# Altium project Audio_Research.PrjPcb (part 4 of 4)

## Sheet Audio_Input_Mic_Preamp.SchDoc: Microphone Preamp
size 381 x 241 mm; DrawnBy: Connor Dack; Engineer: Connor Dack; DocumentNumber: 14; Revision: 1.0; SheetNumber: 14; SheetTotal: 20
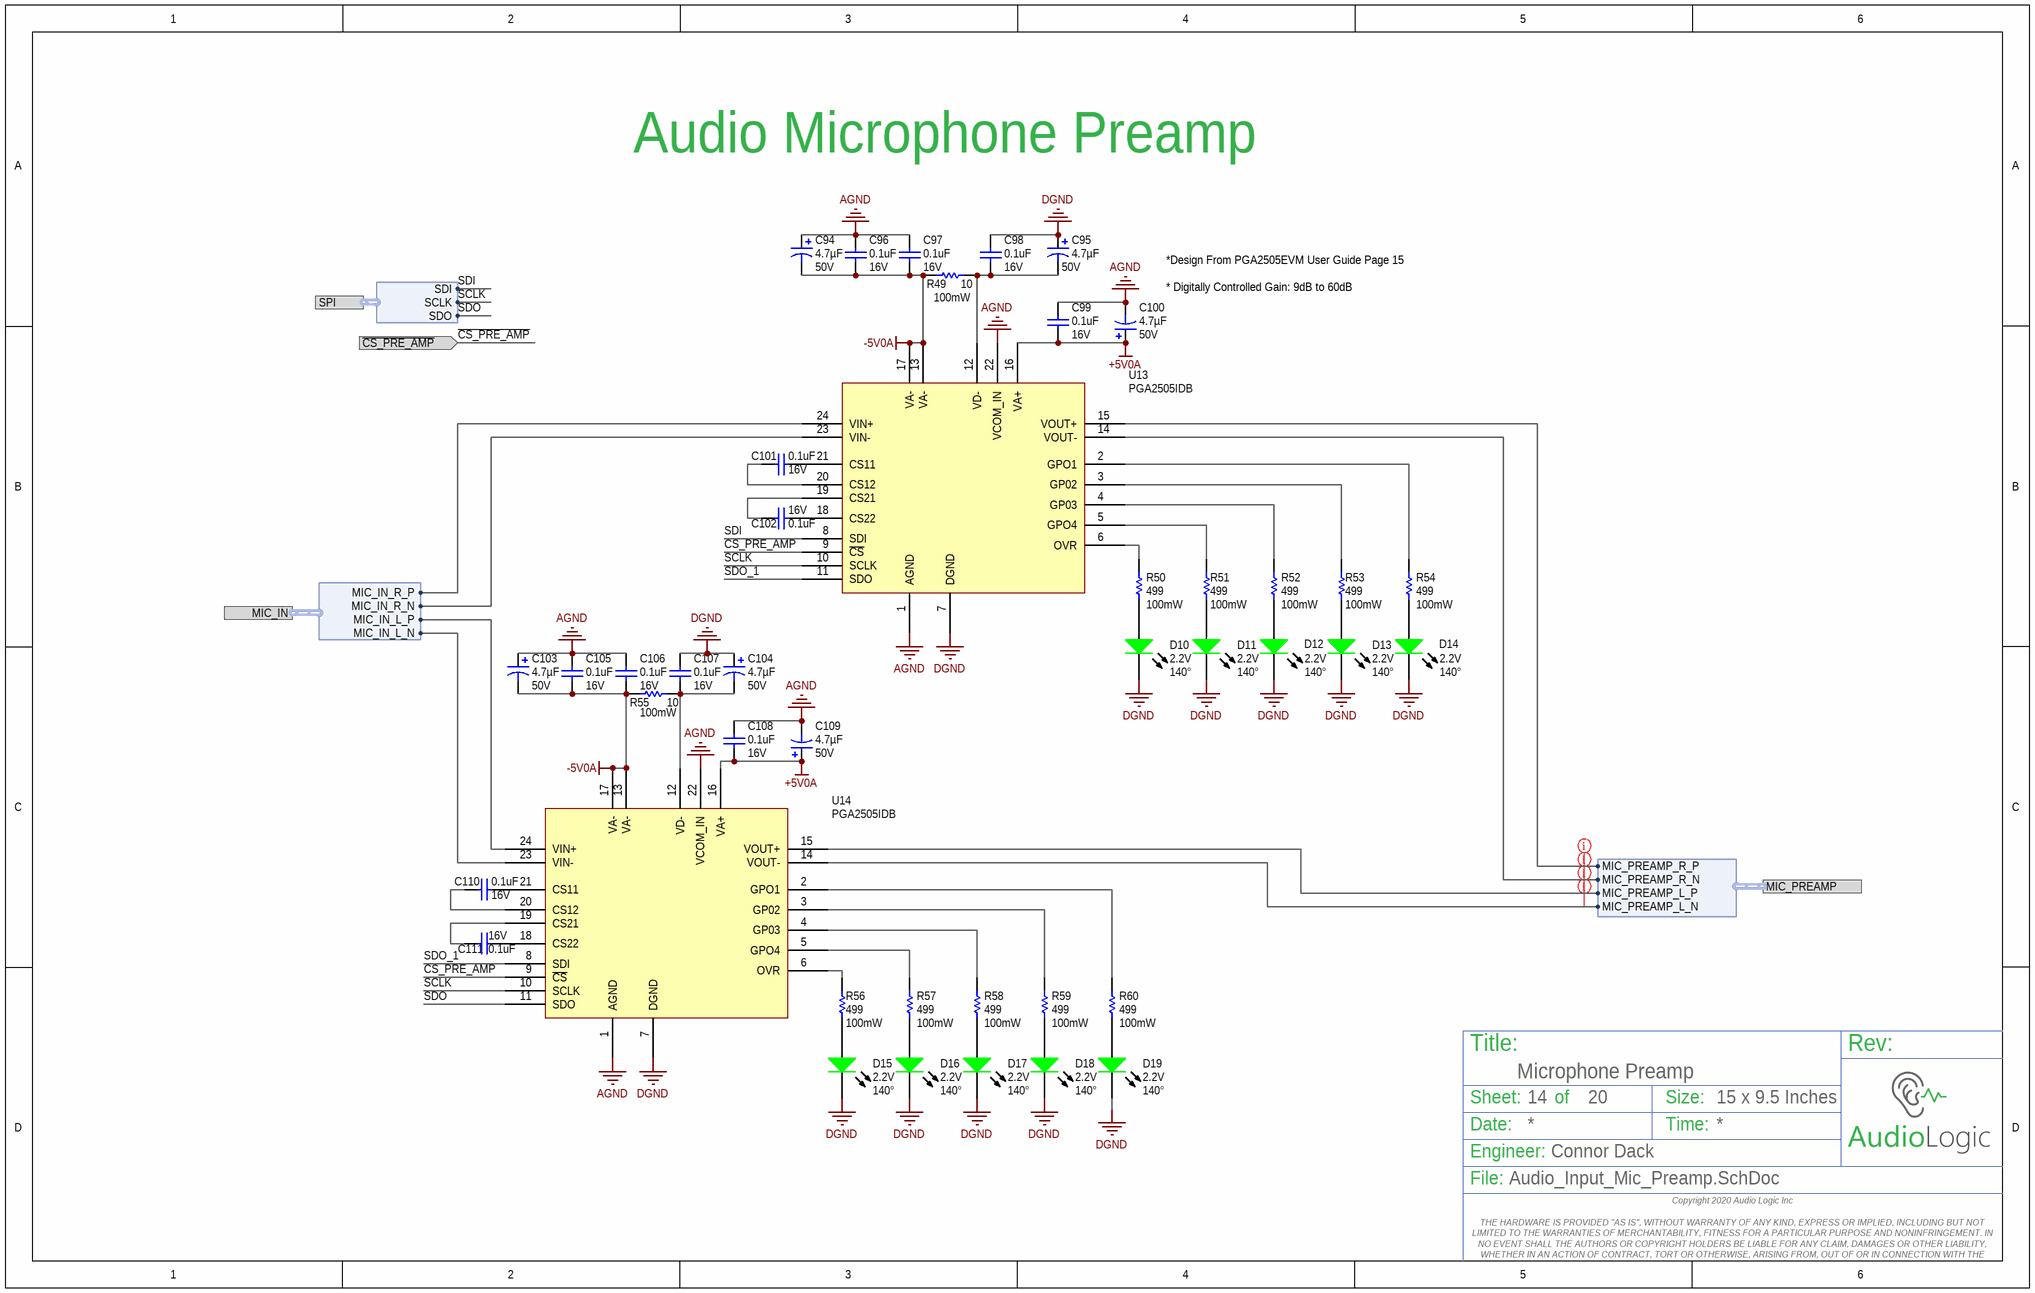
[diagram p11: Audio_Input_Mic_Preamp.SchDoc]

### Parts
C94  Voltage - Rated: 50V  Capacitance: 4.7µF  [2917-Tantalum-Cap]  (hidden comment: T495D475K050ATE275)
C95  Voltage - Rated: 50V  Capacitance: 4.7µF  [2917-Tantalum-Cap]  (hidden comment: T495D475K050ATE275)
C96  Voltage Rating: 16V  Capacitance: 0.1uF  [3-0603_L]  (hidden comment: CL10F104ZO8NNNC)
C97  Voltage Rating: 16V  Capacitance: 0.1uF  [3-0603_L]  (hidden comment: CL10F104ZO8NNNC)
C98  Voltage Rating: 16V  Capacitance: 0.1uF  [3-0603_L]  (hidden comment: CL10F104ZO8NNNC)
C99  Voltage Rating: 16V  Capacitance: 0.1uF  [3-0603_L]  (hidden comment: CL10F104ZO8NNNC)
C100  Voltage - Rated: 50V  Capacitance: 4.7µF  [2917-Tantalum-Cap]  (hidden comment: T495D475K050ATE275)
C101  Voltage Rating: 16V  Capacitance: 0.1uF  [3-0603_L]  (hidden comment: CL10F104ZO8NNNC)
C102  Voltage Rating: 16V  Capacitance: 0.1uF  [3-0603_L]  (hidden comment: CL10F104ZO8NNNC)
C103  Voltage - Rated: 50V  Capacitance: 4.7µF  [2917-Tantalum-Cap]  (hidden comment: T495D475K050ATE275)
C104  Voltage - Rated: 50V  Capacitance: 4.7µF  [2917-Tantalum-Cap]  (hidden comment: T495D475K050ATE275)
C105  Voltage Rating: 16V  Capacitance: 0.1uF  [3-0603_L]  (hidden comment: CL10F104ZO8NNNC)
C106  Voltage Rating: 16V  Capacitance: 0.1uF  [3-0603_L]  (hidden comment: CL10F104ZO8NNNC)
C107  Voltage Rating: 16V  Capacitance: 0.1uF  [3-0603_L]  (hidden comment: CL10F104ZO8NNNC)
C108  Voltage Rating: 16V  Capacitance: 0.1uF  [3-0603_L]  (hidden comment: CL10F104ZO8NNNC)
C109  Voltage - Rated: 50V  Capacitance: 4.7µF  [2917-Tantalum-Cap]  (hidden comment: T495D475K050ATE275)
C110  Voltage Rating: 16V  Capacitance: 0.1uF  [3-0603_L]  (hidden comment: CL10F104ZO8NNNC)
C111  Voltage Rating: 16V  Capacitance: 0.1uF  [3-0603_L]  (hidden comment: CL10F104ZO8NNNC)
D10  Voltage - Forward (Vf) Typ: 2.2V  Viewing Angle: 140°  [DIOCP3216X11L]  (hidden comment: LED_GREEN 2)
D11  Voltage - Forward (Vf) Typ: 2.2V  Viewing Angle: 140°  [DIOCP3216X11L]  (hidden comment: LED_GREEN 2)
D12  Voltage - Forward (Vf) Typ: 2.2V  Viewing Angle: 140°  [DIOCP3216X11L]  (hidden comment: LED_GREEN 2)
D13  Voltage - Forward (Vf) Typ: 2.2V  Viewing Angle: 140°  [DIOCP3216X11L]  (hidden comment: LED_GREEN 2)
D14  Voltage - Forward (Vf) Typ: 2.2V  Viewing Angle: 140°  [DIOCP3216X11L]  (hidden comment: LED_GREEN 2)
D15  Voltage - Forward (Vf) Typ: 2.2V  Viewing Angle: 140°  [DIOCP3216X11L]  (hidden comment: LED_GREEN 2)
D16  Voltage - Forward (Vf) Typ: 2.2V  Viewing Angle: 140°  [DIOCP3216X11L]  (hidden comment: LED_GREEN 2)
D17  Voltage - Forward (Vf) Typ: 2.2V  Viewing Angle: 140°  [DIOCP3216X11L]  (hidden comment: LED_GREEN 2)
D18  Voltage - Forward (Vf) Typ: 2.2V  Viewing Angle: 140°  [DIOCP3216X11L]  (hidden comment: LED_GREEN 2)
D19  Voltage - Forward (Vf) Typ: 2.2V  Viewing Angle: 140°  [DIOCP3216X11L]  (hidden comment: LED_GREEN 2)
R49  Power (Watts): 100mW  Resistance (Ohms): 10  [2-0402_R_L]  (hidden comment: ERJ-2RKF10R0X)
R50  Power (Watts): 100mW  Resistance (Ohms): 499  [3-0603_R_L]  (hidden comment: ERJ-3EKF4990V)
R51  Power (Watts): 100mW  Resistance (Ohms): 499  [3-0603_R_L]  (hidden comment: ERJ-3EKF4990V)
R52  Power (Watts): 100mW  Resistance (Ohms): 499  [3-0603_R_L]  (hidden comment: ERJ-3EKF4990V)
R53  Power (Watts): 100mW  Resistance (Ohms): 499  [3-0603_R_L]  (hidden comment: ERJ-3EKF4990V)
R54  Power (Watts): 100mW  Resistance (Ohms): 499  [3-0603_R_L]  (hidden comment: ERJ-3EKF4990V)
R55  Power (Watts): 100mW  Resistance (Ohms): 10  [2-0402_R_L]  (hidden comment: ERJ-2RKF10R0X)
R56  Power (Watts): 100mW  Resistance (Ohms): 499  [3-0603_R_L]  (hidden comment: ERJ-3EKF4990V)
R57  Power (Watts): 100mW  Resistance (Ohms): 499  [3-0603_R_L]  (hidden comment: ERJ-3EKF4990V)
R58  Power (Watts): 100mW  Resistance (Ohms): 499  [3-0603_R_L]  (hidden comment: ERJ-3EKF4990V)
R59  Power (Watts): 100mW  Resistance (Ohms): 499  [3-0603_R_L]  (hidden comment: ERJ-3EKF4990V)
R60  Power (Watts): 100mW  Resistance (Ohms): 499  [3-0603_R_L]  (hidden comment: ERJ-3EKF4990V)
U13  Microphone Preamp  [SOP65P780X200-24N]  (value not drawn)
U14  Microphone Preamp  [SOP65P780X200-24N]  (value not drawn)

### Ports
MIC_IN (harness MIC_IN), MIC_PREAMP (harness MIC_PREAMP), SPI (harness SPI), ~{CS_PRE_AMP} (in)

### Harnesses
MIC_IN: MIC_IN_R_P, MIC_IN_R_N, MIC_IN_L_N, MIC_IN_L_P
MIC_PREAMP: MIC_PREAMP_R_P, MIC_PREAMP_R_N, MIC_PREAMP_L_N, MIC_PREAMP_L_P
SPI: SDI, SCLK, SDO

### Nets
+5V0A: C99.2 C100.1(P) C108.2 C109.1(P) U13.16(VA+) U14.16(VA+)
-5V0A: C94.2(N) C96.2 C97.2 C103.2(N) C105.2 C106.2 R49.1 R55.1 U13.13(VA-) U13.17(VA-) U14.13(VA-) U14.17(VA-)
AGND: C94.1(P) C95.1(P) C96.1 C97.1 C98.1 C99.1 C100.2(N) C103.1(P) C104.1(P) C105.1 C106.1 C107.1 C108.1 C109.2(N) D10.2(K) D11.2(K) D12.2(K) D13.2(K) D14.2(K) D15.2(K) D16.2(K) D17.2(K) D18.2(K) D19.2(K) U13.1(AGND) U13.7(DGND) U13.22(VCOM_IN) U14.1(AGND) U14.7(DGND) U14.22(VCOM_IN)  [also labelled DGND]
~{CS_PRE_AMP}: U13.9(~{CS}) U14.9(~{CS}) ; port ~{CS_PRE_AMP}
SCLK: U13.10(SCLK) U14.10(SCLK) ; port SPI.SCLK
SDI: U13.8(SDI) ; port SPI.SDI
SDO: U14.11(SDO) ; port SPI.SDO
SDO_1: U13.11(SDO) U14.8(SDI)
NetC70_1: U14.23(VIN-) ; port MIC_IN.MIC_IN_L_N
NetC76_1: U14.24(VIN+) ; port MIC_IN.MIC_IN_L_P
NetC85_1: U13.23(VIN-) ; port MIC_IN.MIC_IN_R_N
NetC90_1: U13.24(VIN+) ; port MIC_IN.MIC_IN_R_P
NetC95_2: C95.2(N) C98.2 R49.2 U13.12(VD-)
NetC101_1: C101.1 U13.21(CS11)
NetC101_2: C101.2 U13.20(CS12)
NetC102_1: C102.1 U13.18(CS22)
NetC102_2: C102.2 U13.19(CS21)
NetC104_2: C104.2(N) C107.2 R55.2 U14.12(VD-)
NetC110_1: C110.1 U14.21(CS11)
NetC110_2: C110.2 U14.20(CS12)
NetC111_1: C111.1 U14.18(CS22)
NetC111_2: C111.2 U14.19(CS21)
NetD10_1: D10.1(A) R50.1
NetD11_1: D11.1(A) R51.1
NetD12_1: D12.1(A) R52.1
NetD13_1: D13.1(A) R53.1
NetD14_1: D14.1(A) R54.1
NetD15_1: D15.1(A) R56.1
NetD16_1: D16.1(A) R57.1
NetD17_1: D17.1(A) R58.1
NetD18_1: D18.1(A) R59.1
NetD19_1: D19.1(A) R60.1
NetR50_2: R50.2 U13.6(OVR)
NetR51_2: R51.2 U13.5(GPO4)
NetR52_2: R52.2 U13.4(GP03)
NetR53_2: R53.2 U13.3(GP02)
NetR54_2: R54.2 U13.2(GPO1)
NetR56_2: R56.2 U14.6(OVR)
NetR57_2: R57.2 U14.5(GPO4)
NetR58_2: R58.2 U14.4(GP03)
NetR59_2: R59.2 U14.3(GP02)
NetR60_2: R60.2 U14.2(GPO1)
NetU1_53: U14.15(VOUT+) ; port MIC_PREAMP.MIC_PREAMP_L_P
NetU1_54: U14.14(VOUT-) ; port MIC_PREAMP.MIC_PREAMP_L_N
NetU1_55: U13.15(VOUT+) ; port MIC_PREAMP.MIC_PREAMP_R_P
NetU1_56: U13.14(VOUT-) ; port MIC_PREAMP.MIC_PREAMP_R_N

### Layout directives
net class Mic_Preamp_In: NetU1_53, NetU1_54, NetU1_55, NetU1_56

### Notes on the sheet
- Audio Microphone Preamp
- (near C100) *Design From PGA2505EVM User Guide Page 15
  * Digitally Controlled Gain: 9dB to 60dB
- Title:
- Sheet:
- of
- Size:
- 15 x 9.5 Inches
- Rev:
- Date:
- Engineer:
- Time:
- File:
- Copyright 2020 Audio Logic Inc
  THE HARDWARE IS PROVIDED "AS IS", WITHOUT WARRANTY OF ANY KIND, EXPRESS OR IMPLIED, INCLUDING BUT NOT LIMITED TO THE WARRANTIES OF MERCHANTABILITY, FITNESS FOR A PARTICULAR PURPOSE AND NONINFRINGEMENT. IN NO EVENT SHALL THE AUTHORS OR COPYRIGHT HOLDERS BE LIABLE FOR ANY CLAIM, DAMAGES OR OTHER LIABILITY, WHETHER IN AN ACTION OF CONTRACT, TORT OR OTHERWISE, ARISING FROM, OUT OF OR IN CONNECTION WITH THE HARDWARE OR THE USE OR OTHER DEALINGS IN THE HARDWARE.

### Library data of the parts
C94 C95 C100 C103 C104 C109 = T495D475K050ATE275: CAP TANT 4.7UF 50V 10% 2917; Manufacturer: KEMET; Manufacturer Size Code: D; Type: Molded; ESR (Equivalent Series Resistance): 275 mOhm; Lifetime @ Temp.: 2000 Hrs @ 85°C; Supplier 1: Digi-Key; Manufacturer Part Number: T495D475K050ATE275; RoHS: RoHS Compliant; Category: Capacitors; Stock 1: 9255; Pricing 1: 1=2.05, 10=1.656, 25=1.5052, 50=1.445, 100=1.2644, 250=1.0838 (USD); Packaging: Cut Tape (CT); Part Status: Active; Tolerance: ±10%; Operating Temperature: -55°C ~ 125°C; Mounting Type: Surface Mount; Package / Case: 2917 (7343 Metric); Size / Dimension: 0.287" L x 0.169" W (7.30mm x 4.30mm); Height - Seated (Max): 0.122" (3.10mm); Lead Spacing: -; Features: General Purpose; Failure Rate: -; ComponentLink1URL: http://www.kemet.com/docfinder?Partnumber=T495D475K050ATE275; ComponentLink1Description: http://www.kemet.com/docfinder?Partnumber=T495D475K050ATE275; Supplier Part Number 1: 399-4786-1-ND
C96-C99 C101 C102 C105-C108 C110 C111 = CL10F104ZO8NNNC: CAP CER 0.1UF 16V Y5V 0603; Manufacturer: Samsung; Tolerance: 80%; Supplier 1: Digi-Key; Stock 1: 40000; Pricing 1: 1=0.1, 10=0.038, 100=0.0169, 500=0.01208, 1000=0.00949 (USD); Mount: Surface Mount; Case/Package: 0603; Case Code (Metric): 1608; Case Code (Imperial): 0603; Min Operating Temperature: -30°C; Max Operating Temperature: 85°C; Package Quantity: 1; Packaging: Tape and Reel; Dielectric: Y5V; Length: 1.6mm; Height: 0.8mm; Width: 0.031inch; Thickness: 0.035inch; Depth: 0.8mm; Radiation Hardening: No; ComponentLink1URL: https://datasheet.ciiva.com/25805/cl10f104zo8nnnc-25805810.pdf; ComponentLink1Description: https://datasheet.ciiva.com/25805/cl10f104zo8nnnc-25805810.pdf; ComponentLink2URL: https://datasheet.ciiva.com/16199/cl10f104zo8nnnc-16199254.pdf; ComponentLink2Description: https://datasheet.ciiva.com/16199/cl10f104zo8nnnc-16199254.pdf; Supplier Part Number 1: 1276-1258-6-ND; Manufacturer Part Number: CL10F104ZO8NNNC
D10-D19 = LED_GREEN 2: LED ALINGAP ULT GRN CLR 1206 SMD; Manufacturer: Lumex Opto/Components Inc; Manufacturer Part Number: SML-LX1206SUGC-TR; Color: Green; Millicandela Rating: 45mcd; Current - Test: 20mA; Wavelength - Peak: 574nm; Lens Type: Clear; Lens Style/Size: Rectangle with Flat Top, 2mm x 1.6mm; Supplier 1: Digi-Key; RoHS: RoHS Compliant; Category: Optoelectronics; Stock 1: 11785; Pricing 1: 1=0.64, 10=0.49, 100=0.3534, 250=0.31352, 500=0.2679, 1000=0.2109 (USD); Wavelength - Dominant: -; Package / Case: 1206 (3216 Metric); Size / Dimension: 3.20mm L x 1.60mm W; Height: 1.10mm; Mounting Type: Surface Mount; Packaging: Cut Tape (CT); Luminous Flux @ Current - Test: -; ComponentLink1URL: http://www.lumex.com/specs/SML-LX1206SUGC-TR.pdf; ComponentLink1Description: http://www.lumex.com/specs/SML-LX1206SUGC-TR.pdf; Supplier Part Number 1: 67-1698-1-ND
R49 R55 = ERJ-2RKF10R0X: RES 10 OHM 1/10W 1% 0402 SMD; Manufacturer: Panasonic Electronic Components; Temperature Coefficient: ±100ppm/°C; Supplier 1: Digi-Key; Manufacturer Part Number: ERJ-2RKF10R0X; RoHS: RoHS Compliant; Category: Resistors; Stock 1: 1086258; Pricing 1: 1=0.1, 50=0.0196, 100=0.0149, 250=0.01104, 500=0.00816, 1000=0.00544, 5000=0.00383 (USD); Packaging: Cut Tape (CT); Tolerance: ±1%; Composition: Thick Film; Features: -; Package / Case: 0402 (1005 Metric); Supplier Device Package: 0402; Size / Dimension: 0.039" L x 0.020" W (1.00mm x 0.50mm); Height: 0.016" (0.40mm); Number of Terminations: 2; ComponentLink1URL: http://industrial.panasonic.com/www-cgi/jvcr13pz.cgi?E+PZ+3+AOA0002+ERJ2RKF10R0X+7+WW; ComponentLink1Description: http://industrial.panasonic.com/www-cgi/jvcr13pz.cgi?E+PZ+3+AOA0002+ERJ2RKF10R0X+7+WW; Supplier Part Number 1: P10.0LCT-ND
R50-R54 R56-R60 = ERJ-3EKF4990V: RES 499 OHM 1/10W 1% 0603 SMD; Manufacturer: Panasonic - ECG; Temperature Coefficient: ±100ppm/°C; Supplier 1: Digi-Key; Manufacturer Part Number: ERJ-3EKF4990V; RoHS: RoHS Compliant; Category: Resistors; Stock 1: 748630; Pricing 1: 1=0.1, 50=0.0138, 100=0.0105, 250=0.0078, 500=0.00576, 1000=0.00384 (USD); Composition: Thick Film; Features: -; Tolerance: ±1%; Package / Case: 0603 (1608 Metric); Size / Dimension: 0.063" L x 0.031" W (1.60mm x 0.80mm); Height: 0.022" (0.55mm); Number of Terminations: 2; Packaging: Cut Tape (CT); ComponentLink1URL: http://industrial.panasonic.com/www-cgi/jvcr13pz.cgi?E+PZ+3+AOA0002+ERJ3EKF4990V+7+WW; ComponentLink1Description: http://industrial.panasonic.com/www-cgi/jvcr13pz.cgi?E+PZ+3+AOA0002+ERJ3EKF4990V+7+WW; Supplier Part Number 1: P499HCT-ND
U13 U14 = PGA2505IDB: IC DGTL CTRLR MICOPHN AMP 24SSOP; Manufacturer: Texas Instruments; Number of Channels: 1; Max Supply Voltage: 5.25V; Min Supply Voltage: 4.75V; Operating Supply Current: 30mA; Input Offset Voltage (Vos): 1mV; Gain: 60dB; Interface: SPI; Dual Supply Voltage: 5V; Input Voltage Noise Density: 3nV/sqrt Hz; Min Dual Supply Voltage: -4.75V; Load Impedance: 600R; Supplier 1: Digi-Key; Stock 1: 358; Pricing 1: 1=10.98, 10=10.088, 100=8.52, 500=7.5792, 1000=6.9519 (USD); Case/Package: SSOP; Number of Pins: 24; Weight: 0.007764oz; Min Operating Temperature: -40°C; Max Operating Temperature: 85°C; Packaging: Rail/Tube; Package Quantity: 60; Max Input Voltage: 5.25V; Quiescent Current: 30mA; Max Dual Supply Voltage: 5.25V; Operating Supply Voltage: 5V; Length: 8.2mm; Height: 1.95mm; Width: 5.3mm; Radiation Hardening: No; REACH SVHC: No SVHC; Lead Free: Lead Free; ComponentLink1URL: https://datasheet.ciiva.com/1789/pga2505-1789587.pdf; ComponentLink1Description: https://datasheet.ciiva.com/1789/pga2505-1789587.pdf; ComponentLink2URL: https://datasheet.ciiva.com/2968/pga2505-2968036.pdf; ComponentLink2Description: https://datasheet.ciiva.com/2968/pga2505-2968036.pdf; ComponentLink3URL: https://datasheet.ciiva.com/15131/getdatasheetpartid-220694-15131828.pdf; ComponentLink3Description: https://datasheet.ciiva.com/15131/getdatasheetpartid-220694-15131828.pdf; ComponentLink4URL: https://datasheet.ciiva.com/26118/sbos396b-26118602.pdf; ComponentLink4Description: https://datasheet.ciiva.com/26118/sbos396b-26118602.pdf; ComponentLink5URL: https://datasheet.ciiva.com/1481/1772560-1481451.pdf; ComponentLink5Description: https://datasheet.ciiva.com/1481/1772560-1481451.pdf; ComponentLink6URL: https://datasheet.ciiva.com/26842/pga2505idb-26842003.pdf; ComponentLink6Description: https://datasheet.ciiva.com/26842/pga2505idb-26842003.pdf; Supplier Part Number 1: 296-24572-5-ND; Manufacturer Part Number: PGA2505IDB

## Sheet Audio_Input_Digitial_Mic.SchDoc: MEMS Microphones
size 279 x 215 mm; DrawnBy: Connor Dack; Engineer: Connor Dack; DocumentNumber: 16; Revision: 1.0; SheetNumber: 16; SheetTotal: 20
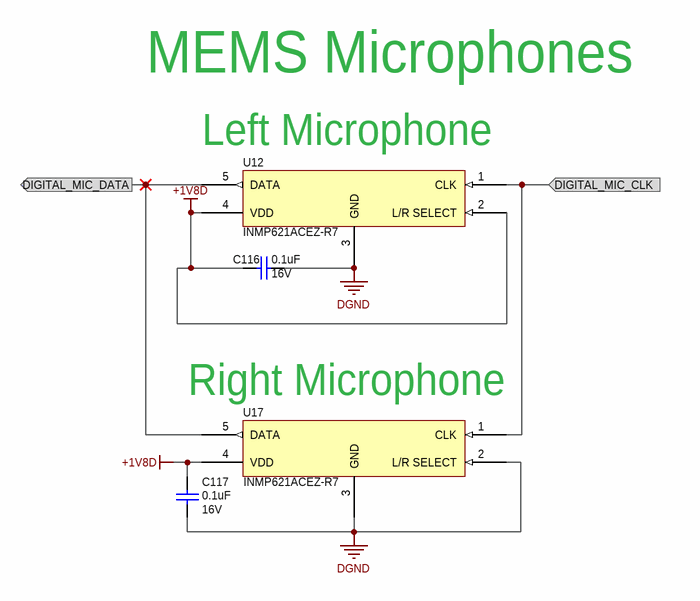
[diagram p12: Audio_Input_Digitial_Mic.SchDoc]

### Parts
C116  Voltage Rating: 16V  Capacitance: 0.1uF  [3-0603_L]  (hidden comment: CL10F104ZO8NNNC)
C117  Voltage Rating: 16V  Capacitance: 0.1uF  [3-0603_L]  (hidden comment: CL10F104ZO8NNNC)
U12  Manufacturer Part Number: INMP621ACEZ-R7  [INMP621]  (hidden comment: INMP621)
U17  Manufacturer Part Number: INMP621ACEZ-R7  [INMP621]  (hidden comment: INMP621)

### Ports
DIGITAL_MIC_CLK (in), DIGITAL_MIC_DATA (out)

### Nets
+1V8D: C116.2 C117.1 U12.2(L/R_SELECT) U12.4(VDD) U17.4(VDD)
DGND: C116.1 C117.2 U12.3(GND) U17.2(L/R_SELECT) U17.3(GND)  [project net AGND]
DIGITAL_MIC_CLK: U12.1(CLK) U17.1(CLK) ; port DIGITAL_MIC_CLK
DIGITAL_MIC_DATA: U12.5(DATA) U17.5(DATA) ; port DIGITAL_MIC_DATA

### Notes on the sheet
- MEMS Microphones
- (near U12) Left Microphone
- (near U17) Right Microphone
- Title:
- Sheet:
- of
- Size:
- 11 x 8.5 Inches
- Rev:
- Date:
- Engineer:
- Time:
- File:
- Copyright 2020 Audio Logic Inc
  THE HARDWARE IS PROVIDED "AS IS", WITHOUT WARRANTY OF ANY KIND, EXPRESS OR IMPLIED, INCLUDING BUT NOT LIMITED TO THE WARRANTIES OF MERCHANTABILITY, FITNESS FOR A PARTICULAR PURPOSE AND NONINFRINGEMENT. IN NO EVENT SHALL THE AUTHORS OR COPYRIGHT HOLDERS BE LIABLE FOR ANY CLAIM, DAMAGES OR OTHER LIABILITY, WHETHER IN AN ACTION OF CONTRACT, TORT OR OTHERWISE, ARISING FROM, OUT OF OR IN CONNECTION WITH THE HARDWARE OR THE USE OR OTHER DEALINGS IN THE HARDWARE.

### Library data of the parts
C116 C117 = CL10F104ZO8NNNC: as C96 on sheet Audio_Input_Mic_Preamp; Supplier 1: Digi-Key; Stock 1: 40000; Pricing 1: 1=0.1, 10=0.038, 100=0.0169, 500=0.01208, 1000=0.00949 (USD); Mount: Surface Mount; Case/Package: 0603; Case Code (Metric): 1608; Case Code (Imperial): 0603; Min Operating Temperature: -30°C; Max Operating Temperature: 85°C; Package Quantity: 1; Packaging: Tape and Reel; Dielectric: Y5V; Length: 1.6mm; Height: 0.8mm; Width: 0.031inch; Thickness: 0.035inch; Depth: 0.8mm; Radiation Hardening: No; ComponentLink1URL: https://datasheet.ciiva.com/25805/cl10f104zo8nnnc-25805810.pdf; ComponentLink1Description: https://datasheet.ciiva.com/25805/cl10f104zo8nnnc-25805810.pdf; ComponentLink2URL: https://datasheet.ciiva.com/16199/cl10f104zo8nnnc-16199254.pdf; ComponentLink2Description: https://datasheet.ciiva.com/16199/cl10f104zo8nnnc-16199254.pdf; Supplier Part Number 1: 1276-1258-6-ND; Manufacturer Part Number: CL10F104ZO8NNNC
U12 U17 = INMP621: 45Hz ~ 20kHz Digital, PDM Microphone MEMS (Silicon) Omnidirectional (-46dB ±2dB @ 94dB SPL) Solder Pads; Manufacturer: InvenSense; S/N Ratio: 65dB; Voltage Range: 1.62 ~ 3.63V; Current - Supply: 1.6mA; Port Location: Bottom; Seal Rating: None; Shape: Rectangular; Supplier 1: Digi-Key; RoHS: RoHS Compliant; Category: Audio Products; Stock 1: 1211; Pricing 1: 1=2.88, 10=2.491, 25=2.2292, 50=1.9668, 100=1.9012, 250=1.83568, 500=1.77012 (USD); Packaging: Cut Tape (CT); Part Status: Active; Type: MEMS (Silicon); Output Type: Digital, PDM; Direction: Omnidirectional; Frequency Range: 45Hz ~ 20kHz; Sensitivity: -46dB ±2dB @ 94dB SPL; Impedance: -; Voltage - Rated: -; Termination: Solder Pads; Size / Dimension: 4.00mm L x 3.00mm W; Height (Max): 1.10mm; ComponentLink1URL: https://www.invensense.com/wp-content/uploads/2015/02/INMP621.pdf; ComponentLink1Description: https://www.invensense.com/wp-content/uploads/2015/02/INMP621.pdf; Supplier Part Number 1: 1428-1018-1-ND

## Sheet FMC_Block_Diagram.SchDoc: FMC Block Diagram
size 381 x 241 mm; DrawnBy: Connor Dack; Engineer: Connor Dack; DocumentNumber: 5; Revision: 1.0; SheetNumber: 5; SheetTotal: 20
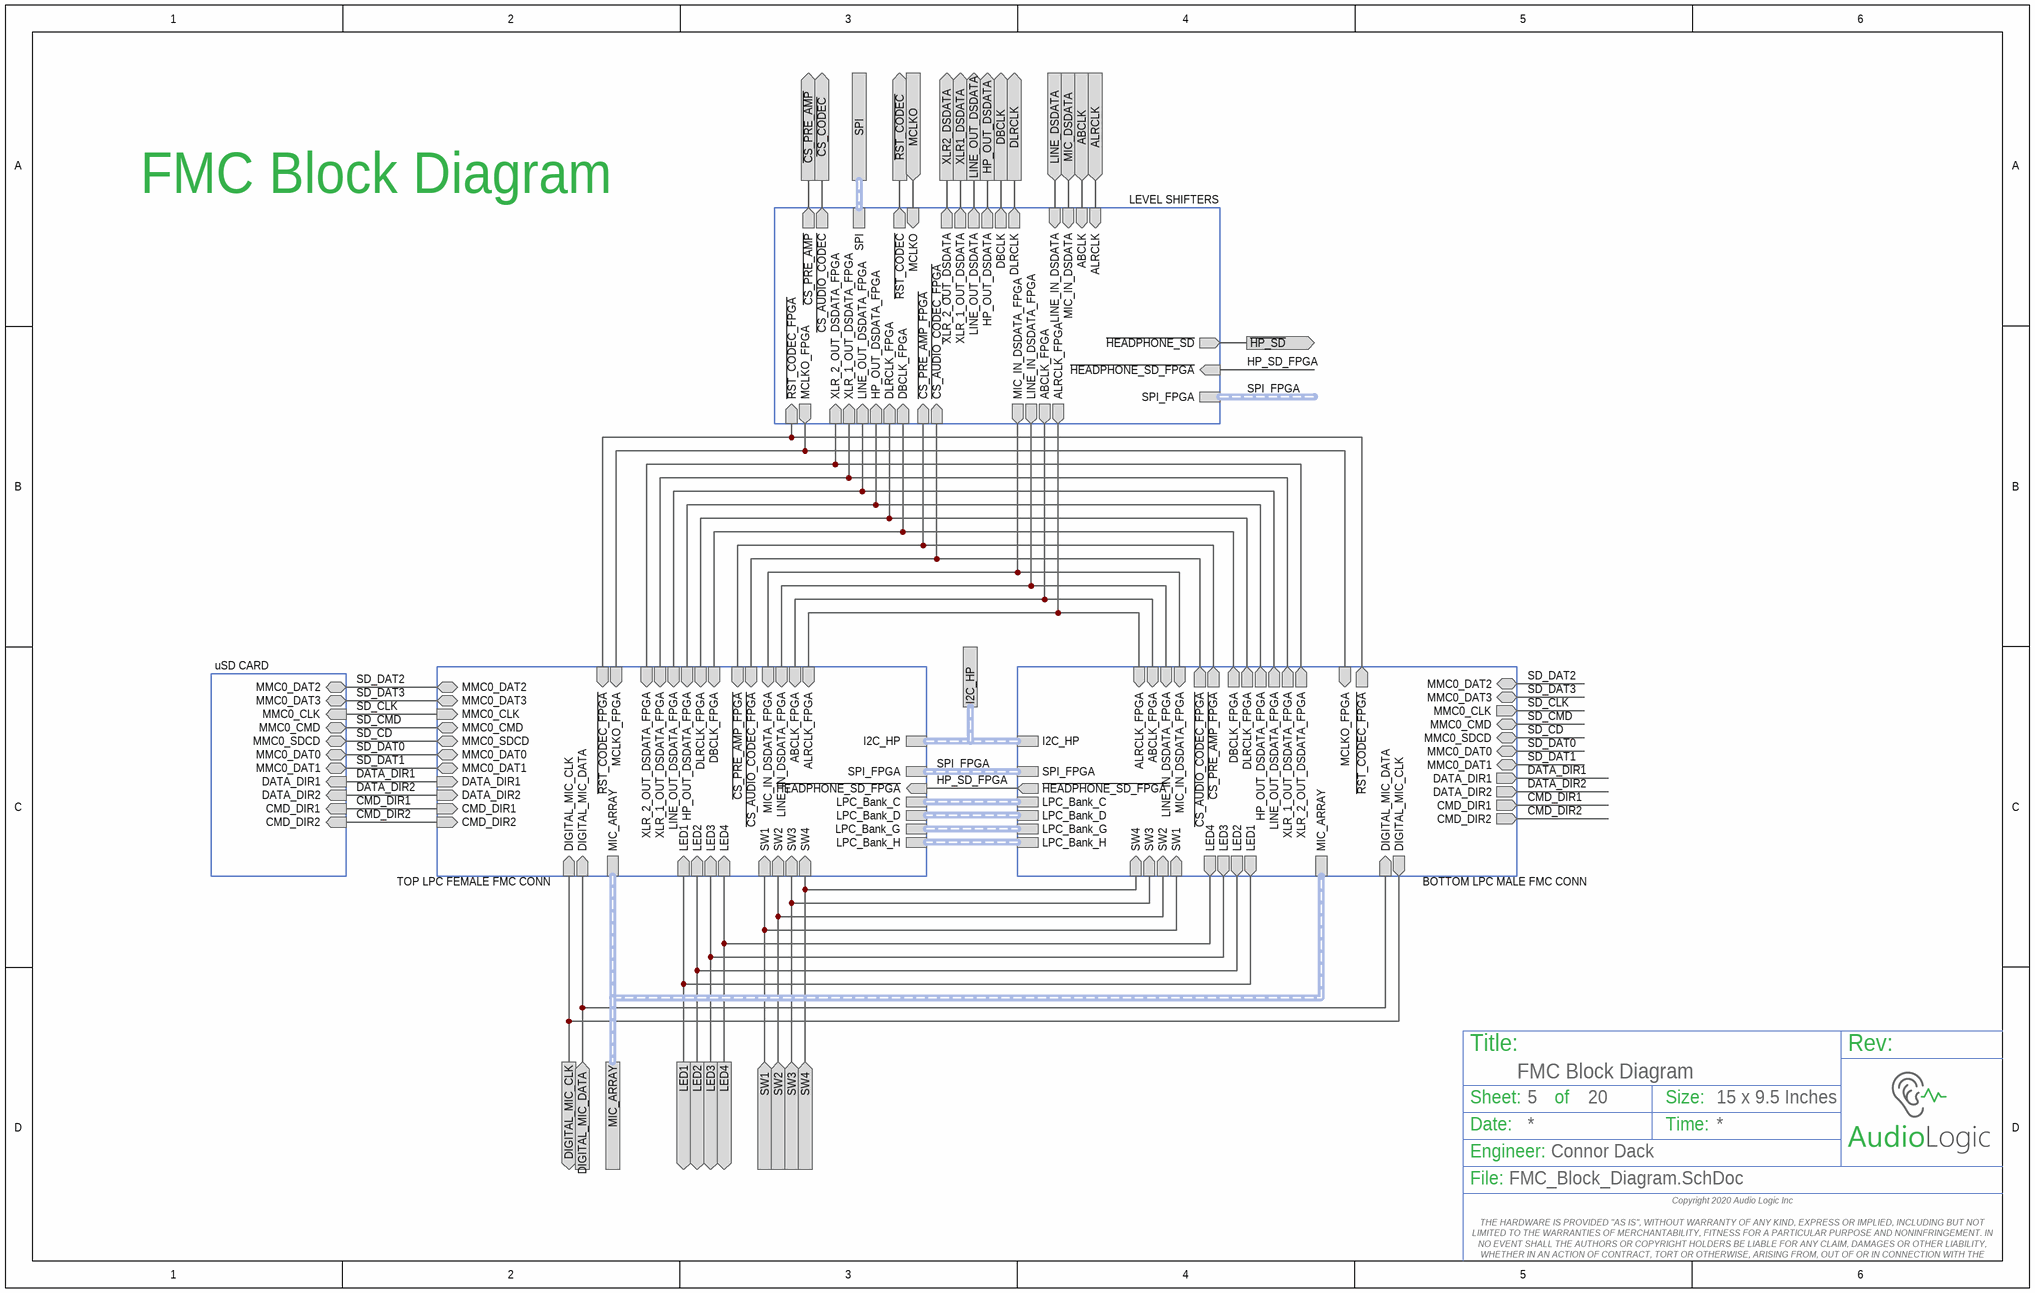
[diagram p13: FMC_Block_Diagram.SchDoc]

### Sub-sheets
BOTTOM LPC MALE FMC CONN = LPC_Male_FMC.SchDoc (file not in this document): SW1 (in), SW3 (in), SW2 (in), SW4 (in), LED1 (out), LED2 (out), LED3 (out), LED4 (out), MIC_ARRAY (harness Microphone Array), ABCLK_FPGA (in), ALRCLK_FPGA (in), DBCLK_FPGA (out), DLRCLK_FPGA (out), HP_OUT_DSDATA_FPGA (out), ~{HEADPHONE_SD_FPGA} (out), LINE_IN_DSDATA_FPGA (in), LINE_OUT_DSDATA_FPGA (out), MCLKO_FPGA (in), MIC_IN_DSDATA_FPGA (in), XLR_1_OUT_DSDATA_FPGA (out), XLR_2_OUT_DSDATA_FPGA (out), ~{RST_CODEC_FPGA} (out), SPI_FPGA (harness SPI_FPGA), ~{CS_AUDIO_CODEC_FPGA} (out), ~{CS_PRE_AMP_FPGA} (out), DIGITAL_MIC_CLK (out), DIGITAL_MIC_DATA (in), I2C_HP (harness I2C), MMC0_DAT2 (bidir), MMC0_DAT3 (bidir), MMC0_CLK (out), MMC0_CMD (bidir), MMC0_SDCD (bidir), MMC0_DAT0 (bidir), MMC0_DAT1 (bidir), LPC_Bank_H (harness LPC_Bank_H), LPC_Bank_G (harness LPC_Bank_G), LPC_Bank_D (harness LPC_Bank_D), LPC_Bank_C (harness LPC_Bank_C), DATA_DIR1 (out), CMD_DIR1 (out), DATA_DIR2 (out), CMD_DIR2 (out)
LEVEL SHIFTERS = Level_Shifters.SchDoc (file not in this document): XLR_2_OUT_DSDATA_FPGA (in), XLR_1_OUT_DSDATA_FPGA (in), LINE_OUT_DSDATA_FPGA (in), MIC_IN_DSDATA_FPGA (out), HP_OUT_DSDATA_FPGA (in), MCLKO_FPGA (out), ~{RST_CODEC_FPGA} (in), ~{HEADPHONE_SD_FPGA} (in), DLRCLK_FPGA (in), DBCLK_FPGA (in), ALRCLK_FPGA (out), ABCLK_FPGA (out), LINE_IN_DSDATA_FPGA (out), XLR_2_OUT_DSDATA (out), HP_OUT_DSDATA (out), MCLKO (in), XLR_1_OUT_DSDATA (out), LINE_OUT_DSDATA (out), MIC_IN_DSDATA (in), ~{RST_CODEC} (out), ~{HEADPHONE_SD} (out), DLRCLK (out), DBCLK (out), ALRCLK (in), ABCLK (in), LINE_IN_DSDATA (in), SPI (harness SPI), SPI_FPGA (harness SPI_FPGA), ~{CS_AUDIO_CODEC} (out), ~{CS_AUDIO_CODEC_FPGA} (in), ~{CS_PRE_AMP} (out), ~{CS_PRE_AMP_FPGA} (in)
TOP LPC FEMALE FMC CONN = LPC_Female_FMC.SchDoc: SW1 (in), SW3 (in), SW2 (in), SW4 (in), LED1 (in), LED2 (in), MIC_ARRAY (harness Microphone Array), LED3 (in), LED4 (in), DBCLK_FPGA (in), DLRCLK_FPGA (in), MIC_IN_DSDATA_FPGA (in), DIGITAL_MIC_DATA (in), ~{HEADPHONE_SD_FPGA} (in), DIGITAL_MIC_CLK (in), MCLKO_FPGA (in), ~{RST_CODEC_FPGA} (in), ALRCLK_FPGA (in), ABCLK_FPGA (in), LINE_IN_DSDATA_FPGA (in), SPI_FPGA (harness SPI_FPGA), HP_OUT_DSDATA_FPGA (in), LINE_OUT_DSDATA_FPGA (in), XLR_1_OUT_DSDATA_FPGA (in), XLR_2_OUT_DSDATA_FPGA (in), ~{CS_AUDIO_CODEC_FPGA} (in), ~{CS_PRE_AMP_FPGA} (in), I2C_HP (harness I2C), MMC0_DAT2 (bidir), MMC0_DAT3 (bidir), MMC0_CLK (in), MMC0_CMD (bidir), MMC0_SDCD (bidir), MMC0_DAT0 (bidir), MMC0_DAT1 (bidir), LPC_Bank_H (harness LPC_Bank_H), LPC_Bank_G (harness LPC_Bank_G), LPC_Bank_D (harness LPC_Bank_D), LPC_Bank_C (harness LPC_Bank_C), DATA_DIR1 (in), CMD_DIR1 (in), DATA_DIR2 (in), CMD_DIR2 (in)
uSD CARD = SD_Card.SchDoc (file not in this document): MMC0_DAT2 (bidir), MMC0_DAT3 (bidir), MMC0_CLK (in), MMC0_CMD (bidir), MMC0_SDCD (bidir), MMC0_DAT0 (bidir), MMC0_DAT1 (bidir), DATA_DIR1 (in), CMD_DIR1 (in), DATA_DIR2 (in), CMD_DIR2 (in)

### Ports
ABCLK (in), ALRCLK (in), DBCLK (out), DIGITAL_MIC_CLK (out), DIGITAL_MIC_DATA (in), DLRCLK (out), HP_OUT_DSDATA (out), I2C_HP, LED1 (out), LED2 (out), LED3 (out), LED4 (out), LINE_DSDATA (in), LINE_OUT_DSDATA (out), MCLKO (in), MIC_ARRAY, MIC_DSDATA (in), SPI, SW1 (in), SW2 (in), SW3 (in), SW4 (in), XLR1_DSDATA (out), XLR2_DSDATA (out), ~{CS_CODEC} (out), ~{CS_PRE_AMP} (out), ~{HP_SD} (out), ~{RST_CODEC} (out)

### Nets
~{HP_SD}: port ~{HP_SD}, sheet LEVEL SHIFTERS/~{HEADPHONE_SD}
ABCLK: port ABCLK, sheet LEVEL SHIFTERS/ABCLK
ALRCLK: port ALRCLK, sheet LEVEL SHIFTERS/ALRCLK
~{CS_CODEC}: port ~{CS_CODEC}, sheet LEVEL SHIFTERS/~{CS_AUDIO_CODEC}
~{CS_PRE_AMP}: port ~{CS_PRE_AMP}, sheet LEVEL SHIFTERS/~{CS_PRE_AMP}
CMD_DIR1: sheet TOP LPC FEMALE FMC CONN/CMD_DIR1, sheet BOTTOM LPC MALE FMC CONN/CMD_DIR1, sheet uSD CARD/CMD_DIR1
CMD_DIR2: sheet TOP LPC FEMALE FMC CONN/CMD_DIR2, sheet BOTTOM LPC MALE FMC CONN/CMD_DIR2, sheet uSD CARD/CMD_DIR2
DATA_DIR1: sheet TOP LPC FEMALE FMC CONN/DATA_DIR1, sheet BOTTOM LPC MALE FMC CONN/DATA_DIR1, sheet uSD CARD/DATA_DIR1
DATA_DIR2: sheet TOP LPC FEMALE FMC CONN/DATA_DIR2, sheet BOTTOM LPC MALE FMC CONN/DATA_DIR2, sheet uSD CARD/DATA_DIR2
DBCLK: port DBCLK, sheet LEVEL SHIFTERS/DBCLK
DIGITAL_MIC_CLK: port DIGITAL_MIC_CLK, sheet TOP LPC FEMALE FMC CONN/DIGITAL_MIC_CLK, sheet BOTTOM LPC MALE FMC CONN/DIGITAL_MIC_CLK
DIGITAL_MIC_DATA: port DIGITAL_MIC_DATA, sheet TOP LPC FEMALE FMC CONN/DIGITAL_MIC_DATA, sheet BOTTOM LPC MALE FMC CONN/DIGITAL_MIC_DATA
DLRCLK: port DLRCLK, sheet LEVEL SHIFTERS/DLRCLK
HP_OUT_DSDATA: port HP_OUT_DSDATA, sheet LEVEL SHIFTERS/HP_OUT_DSDATA
HP_SD_FPGA: sheet TOP LPC FEMALE FMC CONN/~{HEADPHONE_SD_FPGA}, sheet BOTTOM LPC MALE FMC CONN/~{HEADPHONE_SD_FPGA}, sheet LEVEL SHIFTERS/~{HEADPHONE_SD_FPGA}
LED1: port LED1, sheet TOP LPC FEMALE FMC CONN/LED1, sheet BOTTOM LPC MALE FMC CONN/LED1
LED2: port LED2, sheet TOP LPC FEMALE FMC CONN/LED2, sheet BOTTOM LPC MALE FMC CONN/LED2
LED3: port LED3, sheet TOP LPC FEMALE FMC CONN/LED3, sheet BOTTOM LPC MALE FMC CONN/LED3
LED4: port LED4, sheet TOP LPC FEMALE FMC CONN/LED4, sheet BOTTOM LPC MALE FMC CONN/LED4
LINE_DSDATA: port LINE_DSDATA, sheet LEVEL SHIFTERS/LINE_IN_DSDATA
LINE_OUT_DSDATA: port LINE_OUT_DSDATA, sheet LEVEL SHIFTERS/LINE_OUT_DSDATA
MCLKO: port MCLKO, sheet LEVEL SHIFTERS/MCLKO
MIC_DSDATA: port MIC_DSDATA, sheet LEVEL SHIFTERS/MIC_IN_DSDATA
~{RST_CODEC}: port ~{RST_CODEC}, sheet LEVEL SHIFTERS/~{RST_CODEC}
SD_CD: sheet TOP LPC FEMALE FMC CONN/MMC0_SDCD, sheet BOTTOM LPC MALE FMC CONN/MMC0_SDCD, sheet uSD CARD/MMC0_SDCD
SD_CLK: sheet TOP LPC FEMALE FMC CONN/MMC0_CLK, sheet BOTTOM LPC MALE FMC CONN/MMC0_CLK, sheet uSD CARD/MMC0_CLK
SD_CMD: sheet TOP LPC FEMALE FMC CONN/MMC0_CMD, sheet BOTTOM LPC MALE FMC CONN/MMC0_CMD, sheet uSD CARD/MMC0_CMD
SD_DAT0: sheet TOP LPC FEMALE FMC CONN/MMC0_DAT0, sheet BOTTOM LPC MALE FMC CONN/MMC0_DAT0, sheet uSD CARD/MMC0_DAT0
SD_DAT1: sheet TOP LPC FEMALE FMC CONN/MMC0_DAT1, sheet BOTTOM LPC MALE FMC CONN/MMC0_DAT1, sheet uSD CARD/MMC0_DAT1
SD_DAT2: sheet TOP LPC FEMALE FMC CONN/MMC0_DAT2, sheet BOTTOM LPC MALE FMC CONN/MMC0_DAT2, sheet uSD CARD/MMC0_DAT2
SD_DAT3: sheet TOP LPC FEMALE FMC CONN/MMC0_DAT3, sheet BOTTOM LPC MALE FMC CONN/MMC0_DAT3, sheet uSD CARD/MMC0_DAT3
SW1: port SW1, sheet TOP LPC FEMALE FMC CONN/SW1, sheet BOTTOM LPC MALE FMC CONN/SW1
SW2: port SW2, sheet TOP LPC FEMALE FMC CONN/SW2, sheet BOTTOM LPC MALE FMC CONN/SW2
SW3: port SW3, sheet TOP LPC FEMALE FMC CONN/SW3, sheet BOTTOM LPC MALE FMC CONN/SW3
SW4: port SW4, sheet TOP LPC FEMALE FMC CONN/SW4, sheet BOTTOM LPC MALE FMC CONN/SW4
XLR1_DSDATA: port XLR1_DSDATA, sheet LEVEL SHIFTERS/XLR_1_OUT_DSDATA
XLR2_DSDATA: port XLR2_DSDATA, sheet LEVEL SHIFTERS/XLR_2_OUT_DSDATA
(unnamed): sheet TOP LPC FEMALE FMC CONN/DBCLK_FPGA, sheet BOTTOM LPC MALE FMC CONN/DBCLK_FPGA, sheet LEVEL SHIFTERS/DBCLK_FPGA
(unnamed): sheet TOP LPC FEMALE FMC CONN/DLRCLK_FPGA, sheet BOTTOM LPC MALE FMC CONN/DLRCLK_FPGA, sheet LEVEL SHIFTERS/DLRCLK_FPGA
(unnamed): sheet TOP LPC FEMALE FMC CONN/MIC_IN_DSDATA_FPGA, sheet BOTTOM LPC MALE FMC CONN/MIC_IN_DSDATA_FPGA, sheet LEVEL SHIFTERS/MIC_IN_DSDATA_FPGA
(unnamed): sheet TOP LPC FEMALE FMC CONN/MCLKO_FPGA, sheet BOTTOM LPC MALE FMC CONN/MCLKO_FPGA, sheet LEVEL SHIFTERS/MCLKO_FPGA
(unnamed): sheet TOP LPC FEMALE FMC CONN/~{RST_CODEC_FPGA}, sheet BOTTOM LPC MALE FMC CONN/~{RST_CODEC_FPGA}, sheet LEVEL SHIFTERS/~{RST_CODEC_FPGA}
(unnamed): sheet TOP LPC FEMALE FMC CONN/ALRCLK_FPGA, sheet BOTTOM LPC MALE FMC CONN/ALRCLK_FPGA, sheet LEVEL SHIFTERS/ALRCLK_FPGA
(unnamed): sheet TOP LPC FEMALE FMC CONN/ABCLK_FPGA, sheet BOTTOM LPC MALE FMC CONN/ABCLK_FPGA, sheet LEVEL SHIFTERS/ABCLK_FPGA
(unnamed): sheet TOP LPC FEMALE FMC CONN/LINE_IN_DSDATA_FPGA, sheet BOTTOM LPC MALE FMC CONN/LINE_IN_DSDATA_FPGA, sheet LEVEL SHIFTERS/LINE_IN_DSDATA_FPGA
(unnamed): sheet TOP LPC FEMALE FMC CONN/HP_OUT_DSDATA_FPGA, sheet BOTTOM LPC MALE FMC CONN/HP_OUT_DSDATA_FPGA, sheet LEVEL SHIFTERS/HP_OUT_DSDATA_FPGA
(unnamed): sheet TOP LPC FEMALE FMC CONN/LINE_OUT_DSDATA_FPGA, sheet BOTTOM LPC MALE FMC CONN/LINE_OUT_DSDATA_FPGA, sheet LEVEL SHIFTERS/LINE_OUT_DSDATA_FPGA
(unnamed): sheet TOP LPC FEMALE FMC CONN/XLR_1_OUT_DSDATA_FPGA, sheet BOTTOM LPC MALE FMC CONN/XLR_1_OUT_DSDATA_FPGA, sheet LEVEL SHIFTERS/XLR_1_OUT_DSDATA_FPGA
(unnamed): sheet TOP LPC FEMALE FMC CONN/XLR_2_OUT_DSDATA_FPGA, sheet BOTTOM LPC MALE FMC CONN/XLR_2_OUT_DSDATA_FPGA, sheet LEVEL SHIFTERS/XLR_2_OUT_DSDATA_FPGA
(unnamed): sheet TOP LPC FEMALE FMC CONN/~{CS_AUDIO_CODEC_FPGA}, sheet BOTTOM LPC MALE FMC CONN/~{CS_AUDIO_CODEC_FPGA}, sheet LEVEL SHIFTERS/~{CS_AUDIO_CODEC_FPGA}
(unnamed): sheet TOP LPC FEMALE FMC CONN/~{CS_PRE_AMP_FPGA}, sheet BOTTOM LPC MALE FMC CONN/~{CS_PRE_AMP_FPGA}, sheet LEVEL SHIFTERS/~{CS_PRE_AMP_FPGA}

### Buses and harness runs
harness port I2C_HP = sheet BOTTOM LPC MALE FMC CONN/I2C_HP = sheet TOP LPC FEMALE FMC CONN/I2C_HP
harness port MIC_ARRAY = sheet BOTTOM LPC MALE FMC CONN/MIC_ARRAY = sheet TOP LPC FEMALE FMC CONN/MIC_ARRAY
harness port SPI = sheet LEVEL SHIFTERS/SPI
harness sheet BOTTOM LPC MALE FMC CONN/LPC_Bank_C = sheet TOP LPC FEMALE FMC CONN/LPC_Bank_C
harness sheet BOTTOM LPC MALE FMC CONN/LPC_Bank_D = sheet TOP LPC FEMALE FMC CONN/LPC_Bank_D
harness sheet BOTTOM LPC MALE FMC CONN/LPC_Bank_G = sheet TOP LPC FEMALE FMC CONN/LPC_Bank_G
harness sheet BOTTOM LPC MALE FMC CONN/LPC_Bank_H = sheet TOP LPC FEMALE FMC CONN/LPC_Bank_H
harness SPI_FPGA = sheet BOTTOM LPC MALE FMC CONN/SPI_FPGA = sheet TOP LPC FEMALE FMC CONN/SPI_FPGA
harness SPI_FPGA = sheet LEVEL SHIFTERS/SPI_FPGA

### Notes on the sheet
- FMC Block Diagram
- Title:
- Sheet:
- of
- Size:
- 15 x 9.5 Inches
- Rev:
- Date:
- Engineer:
- Time:
- File:
- Copyright 2020 Audio Logic Inc
  THE HARDWARE IS PROVIDED "AS IS", WITHOUT WARRANTY OF ANY KIND, EXPRESS OR IMPLIED, INCLUDING BUT NOT LIMITED TO THE WARRANTIES OF MERCHANTABILITY, FITNESS FOR A PARTICULAR PURPOSE AND NONINFRINGEMENT. IN NO EVENT SHALL THE AUTHORS OR COPYRIGHT HOLDERS BE LIABLE FOR ANY CLAIM, DAMAGES OR OTHER LIABILITY, WHETHER IN AN ACTION OF CONTRACT, TORT OR OTHERWISE, ARISING FROM, OUT OF OR IN CONNECTION WITH THE HARDWARE OR THE USE OR OTHER DEALINGS IN THE HARDWARE.

## Sheet LPC_Female_FMC.SchDoc: LPC Female FMC Conn
size 381 x 241 mm; DrawnBy: Connor Dack; Engineer: Connor Dack; DocumentNumber: 7; Revision: 1.0; SheetNumber: 7; SheetTotal: 20
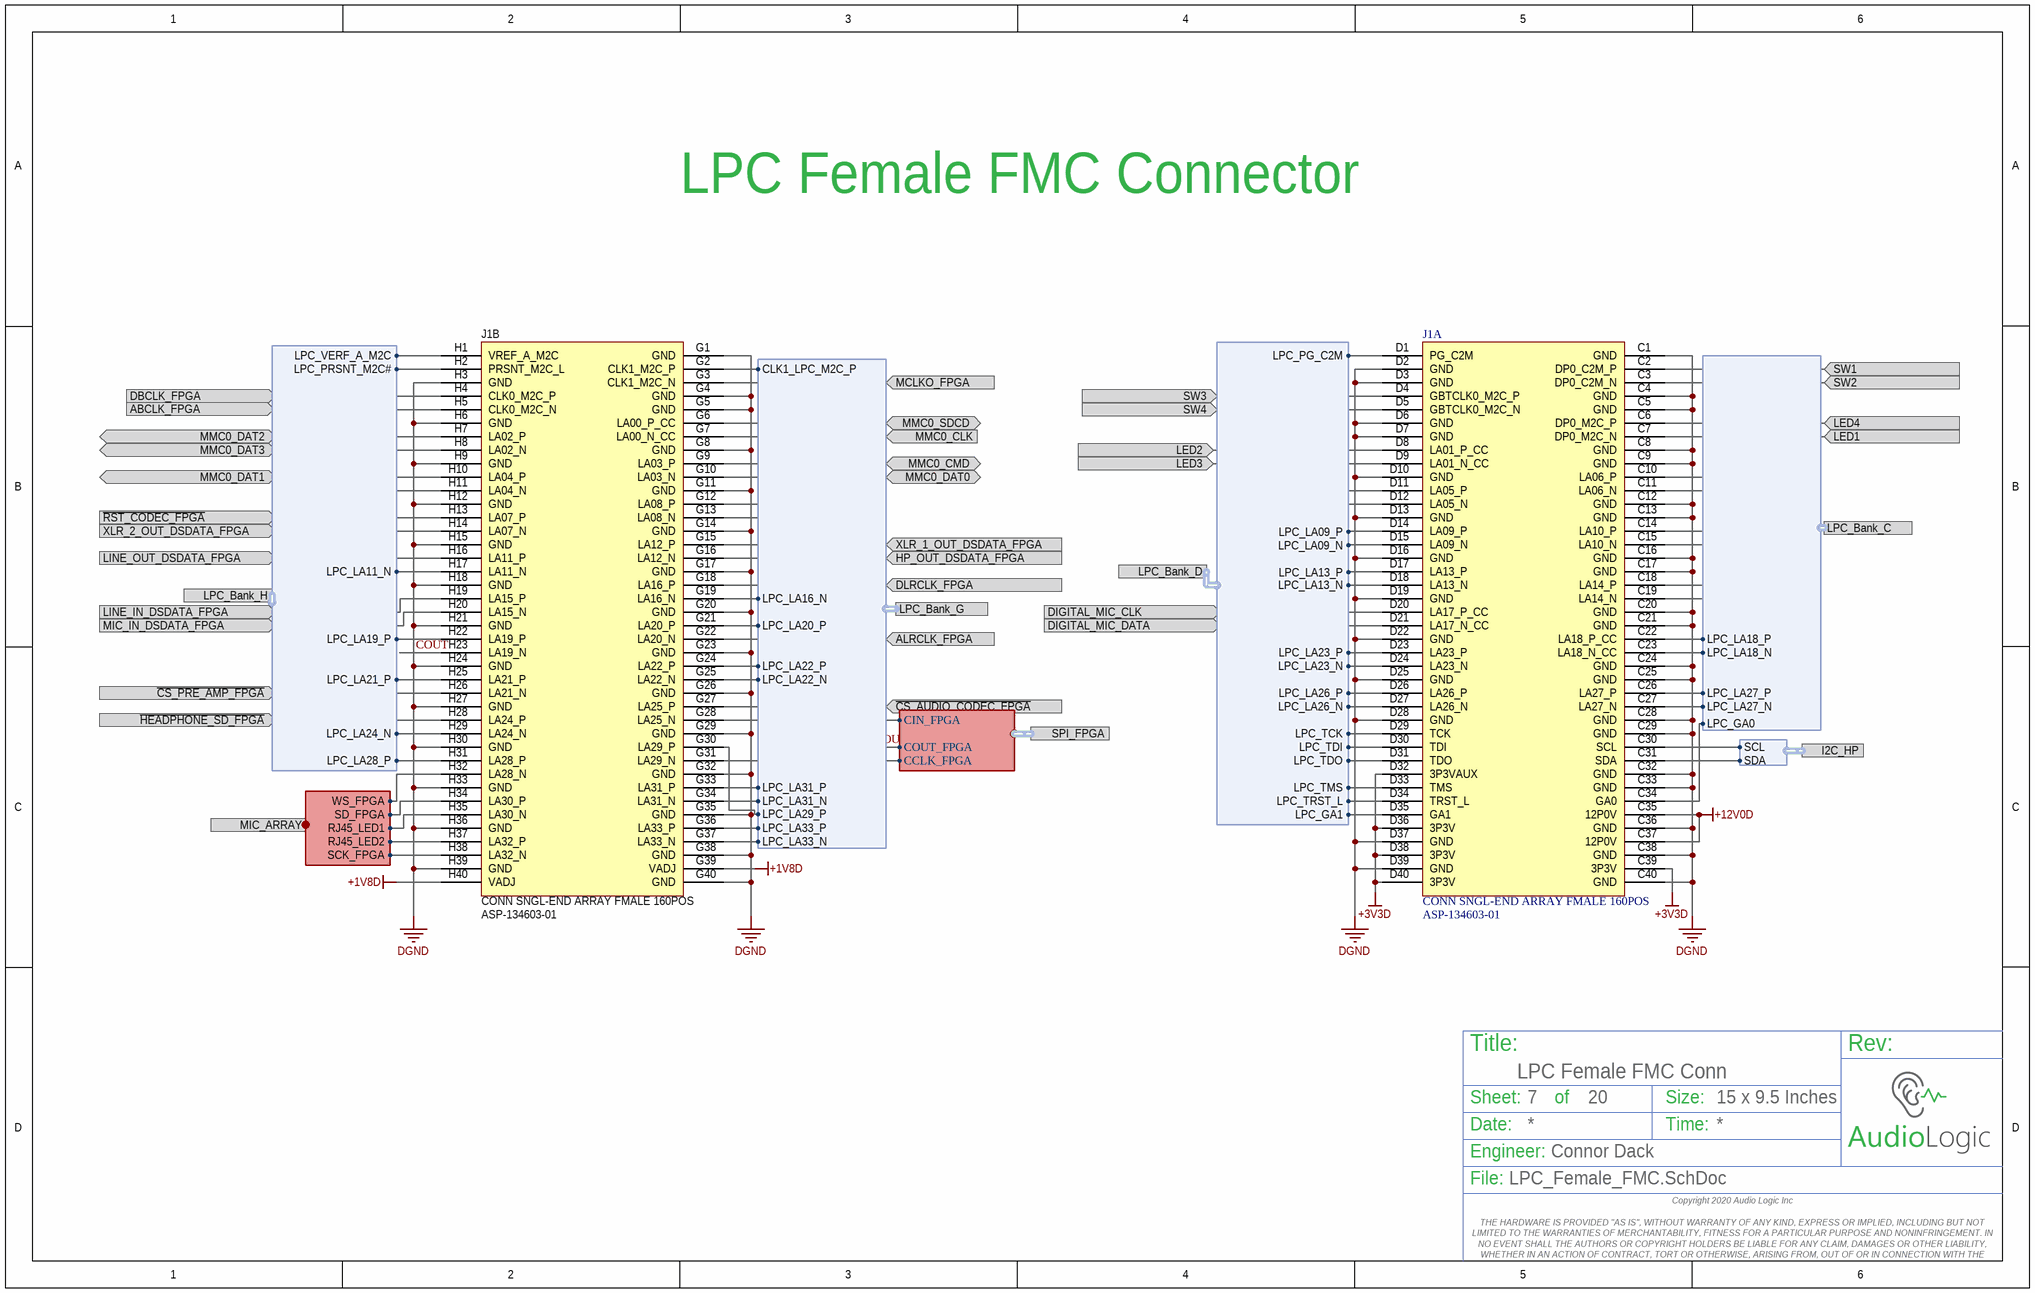
[diagram p14: LPC_Female_FMC.SchDoc]

### Parts
J1  CONN SNGL-END ARRAY FMALE 160POS  [ASP-134603-01]  (parts A,B of 2)

### Ports
ABCLK_FPGA (in), ALRCLK_FPGA (in), CMD_DIR1 (in), CMD_DIR2 (in), DATA_DIR1 (in), DATA_DIR2 (in), DBCLK_FPGA (in), DIGITAL_MIC_CLK (in), DIGITAL_MIC_DATA (in), DLRCLK_FPGA (in), HP_OUT_DSDATA_FPGA (in), I2C_HP (harness I2C), LED1 (in), LED2 (in), LED3 (in), LED4 (in), LINE_IN_DSDATA_FPGA (in), LINE_OUT_DSDATA_FPGA (in), LPC_Bank_C (harness LPC_Bank_C), LPC_Bank_D (harness LPC_Bank_D), LPC_Bank_G (harness LPC_Bank_G), LPC_Bank_H (harness LPC_Bank_H), MCLKO_FPGA (in), MIC_ARRAY (harness Microphone Array), MIC_IN_DSDATA_FPGA (in), MMC0_CLK (in), MMC0_CMD (bidir), MMC0_DAT0 (bidir), MMC0_DAT1 (bidir), MMC0_DAT2 (bidir), MMC0_DAT3 (bidir), MMC0_SDCD (bidir), SPI_FPGA (harness SPI_FPGA), SW1 (in), SW2 (in), SW3 (in), SW4 (in), XLR_1_OUT_DSDATA_FPGA (in), XLR_2_OUT_DSDATA_FPGA (in), ~{CS_AUDIO_CODEC_FPGA} (in), ~{CS_PRE_AMP_FPGA} (in), ~{HEADPHONE_SD_FPGA} (in), ~{RST_CODEC_FPGA} (in)

### Harnesses
LPC_Bank_C: LPC_GA0, LPC_LA18_P, LPC_LA18_N, LPC_LA27_P, LPC_LA27_N
LPC_Bank_D: LPC_PG_C2M, LPC_TCK, LPC_TDI, LPC_TDO, LPC_TMS, LPC_TRST_L, LPC_GA1, LPC_LA13_N, LPC_LA23_P, LPC_LA23_N, LPC_LA26_P, LPC_LA26_N, LPC_LA13_P, LPC_LA09_N, LPC_LA09_P
LPC_Bank_H: LPC_VERF_A_M2C, LPC_PRSNT_M2C#, LPC_LA21_P, LPC_LA24_N, LPC_LA28_P, LPC_LA19_P, LPC_LA11_N
SPI_FPGA: CIN_FPGA, COUT_FPGA, CCLK_FPGA
Microphone Array: SD_FPGA, SCK_FPGA, WS_FPGA, RJ45_LED1, RJ45_LED2
I2C: SDA, SCL
LPC_Bank_G: CLK1_LPC_M2C_P, LPC_LA20_P, LPC_LA22_P, LPC_LA22_N, LPC_LA31_P, LPC_LA31_N, LPC_LA33_P, LPC_LA33_N, LPC_LA29_P, LPC_LA16_N

### Nets
+1V8D: J1.G39(VADJ) J1.H40(VADJ)
+3V3D: J1.C39(3P3V) J1.D32(3P3VAUX) J1.D36(3P3V) J1.D38(3P3V) J1.D40(3P3V)
+12V0D: J1.C10(LA06_P) J1.C11(LA06_N) J1.C35(12P0V) J1.C37(12P0V) J1.D11(LA05_P) J1.D12(LA05_N) J1.G12(LA08_P) J1.G13(LA08_N) J1.H11(LA04_N)
DGND: J1.C1(GND) J1.C4(GND) J1.C5(GND) J1.C8(GND) J1.C9(GND) J1.C12(GND) J1.C13(GND) J1.C16(GND) J1.C17(GND) J1.C20(GND) J1.C21(GND) J1.C24(GND) J1.C25(GND) J1.C28(GND) J1.C29(GND) J1.C32(GND) J1.C33(GND) J1.C36(GND) J1.C38(GND) J1.C40(GND) J1.D2(GND) J1.D3(GND) J1.D6(GND) J1.D7(GND) J1.D10(GND) J1.D13(GND) J1.D16(GND) J1.D19(GND) J1.D22(GND) J1.D25(GND) J1.D28(GND) J1.D37(GND) J1.D39(GND) J1.G1(GND) J1.G4(GND) J1.G5(GND) J1.G8(GND) J1.G11(GND) J1.G14(GND) J1.G17(GND) J1.G20(GND) J1.G23(GND) J1.G26(GND) J1.G29(GND) J1.G32(GND) J1.G35(GND) J1.G38(GND) J1.G40(GND) J1.H3(GND) J1.H6(GND) J1.H9(GND) J1.H12(GND) J1.H15(GND) J1.H18(GND) J1.H21(GND) J1.H24(GND) J1.H27(GND) J1.H30(GND) J1.H33(GND) J1.H36(GND) J1.H39(GND)  [project net AGND]
~{RST_CODEC_FPGA}: J1.H13(LA07_P) ; port ~{RST_CODEC_FPGA}
ABCLK_FPGA: J1.H5(CLK0_M2C_N) ; port ABCLK_FPGA
ALRCLK_FPGA: J1.G22(LA20_N) ; port ALRCLK_FPGA
~{CS_AUDIO_CODEC_FPGA}: J1.G27(LA25_P) ; port ~{CS_AUDIO_CODEC_FPGA}
~{CS_PRE_AMP_FPGA}: J1.H26(LA21_N) ; port ~{CS_PRE_AMP_FPGA}
CMD_DIR1: J1.C19(LA14_N) ; port CMD_DIR1
CMD_DIR2: J1.C18(LA14_P) ; port CMD_DIR2
COUT: J1.H23(LA19_N) ; port SPI_FPGA.COUT_FPGA
DATA_DIR1: J1.C15(LA10_N) ; port DATA_DIR1
DATA_DIR2: J1.C14(LA10_P) ; port DATA_DIR2
DBCLK_FPGA: J1.H4(CLK0_M2C_P) ; port DBCLK_FPGA
DIGITAL_MIC_CLK: J1.D20(LA17_P_CC) ; port DIGITAL_MIC_CLK
DIGITAL_MIC_DATA: J1.D21(LA17_N_CC) ; port DIGITAL_MIC_DATA
DLRCLK_FPGA: J1.G18(LA16_P) ; port DLRCLK_FPGA
~{HEADPHONE_SD_FPGA}: J1.H28(LA24_P) ; port ~{HEADPHONE_SD_FPGA}
HP_OUT_DSDATA_FPGA: J1.G16(LA12_N) ; port HP_OUT_DSDATA_FPGA
LED1: J1.C7(DP0_M2C_N) ; port LED1
LED2: J1.D8(LA01_P_CC) ; port LED2
LED3: J1.D9(LA01_N_CC) ; port LED3
LED4: J1.C6(DP0_M2C_P) ; port LED4
LINE_IN_DSDATA_FPGA: J1.H19(LA15_P) ; port LINE_IN_DSDATA_FPGA
LINE_OUT_DSDATA_FPGA: J1.H16(LA11_P) ; port LINE_OUT_DSDATA_FPGA
MCLKO_FPGA: J1.G3(CLK1_M2C_N) ; port MCLKO_FPGA
MIC_IN_DSDATA_FPGA: J1.H20(LA15_N) ; port MIC_IN_DSDATA_FPGA
MMC0_CLK: J1.G7(LA00_N_CC) ; port MMC0_CLK
MMC0_CMD: J1.G9(LA03_P) ; port MMC0_CMD
MMC0_DAT0: J1.G10(LA03_N) ; port MMC0_DAT0
MMC0_DAT1: J1.H10(LA04_P) ; port MMC0_DAT1
MMC0_DAT2: J1.H7(LA02_P) ; port MMC0_DAT2
MMC0_DAT3: J1.H8(LA02_N) ; port MMC0_DAT3
MMC0_SDCD: J1.G6(LA00_P_CC) ; port MMC0_SDCD
RJ45_LED1: J1.H35(LA30_N) ; port MIC_ARRAY.RJ45_LED1
RJ45_LED2: J1.H37(LA32_P) ; port MIC_ARRAY.RJ45_LED2
SW1: J1.C2(DP0_C2M_P) ; port SW1
SW2: J1.C3(DP0_C2M_N) ; port SW2
SW3: J1.D4(GBTCLK0_M2C_P) ; port SW3
SW4: J1.D5(GBTCLK0_M2C_N) ; port SW4
XLR_1_OUT_DSDATA_FPGA: J1.G15(LA12_P) ; port XLR_1_OUT_DSDATA_FPGA
XLR_2_OUT_DSDATA_FPGA: J1.H14(LA07_N) ; port XLR_2_OUT_DSDATA_FPGA
NetJ1_C22: J1.C22(LA18_P_CC) ; port LPC_Bank_C.LPC_LA18_P
NetJ1_C23: J1.C23(LA18_N_CC) ; port LPC_Bank_C.LPC_LA18_N
NetJ1_C26: J1.C26(LA27_P) ; port LPC_Bank_C.LPC_LA27_P
NetJ1_C27: J1.C27(LA27_N) ; port LPC_Bank_C.LPC_LA27_N
NetJ1_C30: J1.C30(SCL) ; port I2C_HP.SCL
NetJ1_C31: J1.C31(SDA) ; port I2C_HP.SDA
NetJ1_C34: J1.C34(GA0) ; port LPC_Bank_C.LPC_GA0
NetJ1_D1: J1.D1(PG_C2M) ; port LPC_Bank_D.LPC_PG_C2M
NetJ1_D14: J1.D14(LA09_P) ; port LPC_Bank_D.LPC_LA09_P
NetJ1_D15: J1.D15(LA09_N) ; port LPC_Bank_D.LPC_LA09_N
NetJ1_D17: J1.D17(LA13_P) ; port LPC_Bank_D.LPC_LA13_P
NetJ1_D18: J1.D18(LA13_N) ; port LPC_Bank_D.LPC_LA13_N
NetJ1_D23: J1.D23(LA23_P) ; port LPC_Bank_D.LPC_LA23_P
NetJ1_D24: J1.D24(LA23_N) ; port LPC_Bank_D.LPC_LA23_N
NetJ1_D26: J1.D26(LA26_P) ; port LPC_Bank_D.LPC_LA26_P
NetJ1_D27: J1.D27(LA26_N) ; port LPC_Bank_D.LPC_LA26_N
NetJ1_D29: J1.D29(TCK) ; port LPC_Bank_D.LPC_TCK
NetJ1_D30: J1.D30(TDI) ; port LPC_Bank_D.LPC_TDI
NetJ1_D31: J1.D31(TDO) ; port LPC_Bank_D.LPC_TDO
NetJ1_D33: J1.D33(TMS) ; port LPC_Bank_D.LPC_TMS
NetJ1_D34: J1.D34(TRST_L) ; port LPC_Bank_D.LPC_TRST_L
NetJ1_D35: J1.D35(GA1) ; port LPC_Bank_D.LPC_GA1
NetJ1_G2: J1.G2(CLK1_M2C_P) ; port LPC_Bank_G.CLK1_LPC_M2C_P
NetJ1_G19: J1.G19(LA16_N) ; port LPC_Bank_G.LPC_LA16_N
NetJ1_G21: J1.G21(LA20_P) ; port LPC_Bank_G.LPC_LA20_P
NetJ1_G24: J1.G24(LA22_P) ; port LPC_Bank_G.LPC_LA22_P
NetJ1_G25: J1.G25(LA22_N) ; port LPC_Bank_G.LPC_LA22_N
NetJ1_G28: J1.G28(LA25_N) ; port SPI_FPGA.CIN_FPGA
NetJ1_G30: J1.G30(LA29_P) ; port LPC_Bank_G.LPC_LA29_P
NetJ1_G31: J1.G31(LA29_N) ; port SPI_FPGA.CCLK_FPGA
NetJ1_G33: J1.G33(LA31_P) ; port LPC_Bank_G.LPC_LA31_P
NetJ1_G34: J1.G34(LA31_N) ; port LPC_Bank_G.LPC_LA31_N
NetJ1_G36: J1.G36(LA33_P) ; port LPC_Bank_G.LPC_LA33_P
NetJ1_G37: J1.G37(LA33_N) ; port LPC_Bank_G.LPC_LA33_N
NetJ1_H1: J1.H1(VREF_A_M2C) ; port LPC_Bank_H.LPC_VERF_A_M2C
NetJ1_H2: J1.H2(PRSNT_M2C_L) ; port LPC_Bank_H.LPC_PRSNT_M2C#
NetJ1_H17: J1.H17(LA11_N) ; port LPC_Bank_H.LPC_LA11_N
NetJ1_H22: J1.H22(LA19_P) ; port LPC_Bank_H.LPC_LA19_P
NetJ1_H25: J1.H25(LA21_P) ; port LPC_Bank_H.LPC_LA21_P
NetJ1_H29: J1.H29(LA24_N) ; port LPC_Bank_H.LPC_LA24_N
NetJ1_H31: J1.H31(LA28_P) ; port LPC_Bank_H.LPC_LA28_P
NetJ1_H32: J1.H32(LA28_N) ; port MIC_ARRAY.WS_FPGA
NetJ1_H34: J1.H34(LA30_P) ; port MIC_ARRAY.SD_FPGA
NetJ1_H38: J1.H38(LA32_N) ; port MIC_ARRAY.SCK_FPGA

### Notes on the sheet
- LPC Female FMC Connector
- Title:
- Sheet:
- of
- Size:
- 15 x 9.5 Inches
- Rev:
- Date:
- Engineer:
- Time:
- File:
- Copyright 2020 Audio Logic Inc
  THE HARDWARE IS PROVIDED "AS IS", WITHOUT WARRANTY OF ANY KIND, EXPRESS OR IMPLIED, INCLUDING BUT NOT LIMITED TO THE WARRANTIES OF MERCHANTABILITY, FITNESS FOR A PARTICULAR PURPOSE AND NONINFRINGEMENT. IN NO EVENT SHALL THE AUTHORS OR COPYRIGHT HOLDERS BE LIABLE FOR ANY CLAIM, DAMAGES OR OTHER LIABILITY, WHETHER IN AN ACTION OF CONTRACT, TORT OR OTHERWISE, ARISING FROM, OUT OF OR IN CONNECTION WITH THE HARDWARE OR THE USE OR OTHER DEALINGS IN THE HARDWARE.

### Library data of the parts
J1 = ASP-134603-01: Low Pin Count Female FPGA Mezzanine Card Connector; Manufacturer: Samtec; Number of Positions: 160; Gender: Receptacle; Pitch: 1.27mm; Load Status: DNI; Supplier 1: Digi-Key; Stock 1: 418; Pricing 1: 1=12.68, 10=12.253, 25=11.83, 50=11.4076, 100=10.985, 250=10.7738, 500=10.5625 (USD); Mount: Surface Mount; Contact Plating: Nickel,Gold; Contact Material: Copper Alloy; Housing Colour: Black; Number of Rows: 4; Packaging: Tape and Reel; Termination: Solder; Number of Contacts: 160; Orientation: Straight; Depth: 13.23mm; Radiation Hardening: No; REACH SVHC: No SVHC; ComponentLink1URL: https://datasheet.ciiva.com/403/asp-134603-01-403748.pdf; ComponentLink1Description: https://datasheet.ciiva.com/403/asp-134603-01-403748.pdf; ComponentLink2URL: https://datasheet.ciiva.com/26877/getdatasheetpartid-748375-26877304.pdf; ComponentLink2Description: https://datasheet.ciiva.com/26877/getdatasheetpartid-748375-26877304.pdf; Supplier Part Number 1: SAM8729-ND; Manufacturer Part Number: ASP-134603-01

## Nets that join several sheets
+1V8D: Power (C39.2 C40.2 R10.2), Audio_Input_Mic_Array (C115.1 U16.16), Audio_Input_Digitial_Mic (5 pins), LPC_Female_FMC (J1.G39 J1.H40)
+3V3A: Audio_Codec (10 pins), Power (5 pins)
+3V3D: Audio_Codec (6 pins), Power (C37.2 C38.2 R9.2), Audio_Input_Mic_Array (8 pins), LPC_Female_FMC (5 pins)
+5V0A: Audio_Input_Line_In (C58.2 C67.2 U8.8 U9.8), Power (20 pins), Audio_Output_Line_Out (C126.2 C128.1 U19.8 U19.14), Audio_Output_XLR1 (C130.1 C133.1 U21.12 U22.12), Audio_Output_XLR2 (C136.1 C139.1 U23.12 U24.12), Audio_Input_Mic_In (6 pins), Audio_Input_Mic_Preamp (6 pins)
+12V0D: Power (8 pins), LPC_Female_FMC (9 pins)
-5V0A: Audio_Input_Line_In (C51.2 C60.2 U8.4 U9.4), Power (C28.2 R6.2), Audio_Output_Line_Out (C127.2 C129.1 U19.10 U19.12), Audio_Output_XLR1 (C132.1 C135.1 U21.11 U22.11), Audio_Output_XLR2 (C138.1 C141.1 U23.11 U24.11), Audio_Input_Mic_In (C69.2 C84.2 U10.4 U11.4), Audio_Input_Mic_Preamp (12 pins)
AGND: Audio_Codec (25 pins), Audio_Input_Line_In (13 pins), Power (40 pins), Audio_Output_Line_Out (8 pins), Audio_Output_XLR1 (20 pins), Audio_Output_XLR2 (20 pins), Audio_Input_Mic_In (20 pins), Audio_Input_Mic_Array (16 pins), Audio_Input_Mic_Preamp (30 pins), Audio_Input_Digitial_Mic (5 pins), LPC_Female_FMC (61 pins)
DIGITAL_MIC_CLK: Audio_Input_Digitial_Mic (U12.1 U17.1), LPC_Female_FMC (J1.D20)
DIGITAL_MIC_DATA: Audio_Input_Digitial_Mic (U12.5 U17.5), LPC_Female_FMC (J1.D21)
NetC52_1: Audio_Codec (U1.58), Audio_Input_Line_In (C52.1 C55.2 R23.2)
NetC55_1: Audio_Codec (U1.57), Audio_Input_Line_In (C55.1 C57.2 R26.2)
NetC62_1: Audio_Codec (U1.60), Audio_Input_Line_In (C62.1 C64.2 R29.2)
NetC64_1: Audio_Codec (U1.59), Audio_Input_Line_In (C64.1 C66.2 R32.2)
NetC70_1: Audio_Input_Mic_In (C70.1 C76.2 R35.2), Audio_Input_Mic_Preamp (U14.23)
NetC76_1: Audio_Input_Mic_In (C76.1 C78.2 R39.2), Audio_Input_Mic_Preamp (U14.24)
NetC85_1: Audio_Input_Mic_In (C85.1 C90.2 R44.2), Audio_Input_Mic_Preamp (U13.23)
NetC90_1: Audio_Input_Mic_In (C90.1 C92.2 R48.2), Audio_Input_Mic_Preamp (U13.24)
NetJ1_H32: Audio_Input_Mic_Array (U16.11), LPC_Female_FMC (J1.H32)
NetJ1_H34: Audio_Input_Mic_Array (U16.13), LPC_Female_FMC (J1.H34)
NetJ1_H38: Audio_Input_Mic_Array (U16.10), LPC_Female_FMC (J1.H38)
NetR68_1: Audio_Codec (U1.40), Audio_Output_Line_Out (R68.1)
NetR70_1: Audio_Codec (U1.41), Audio_Output_Line_Out (R70.1)
NetR71_1: Audio_Codec (U1.43), Audio_Output_Line_Out (R71.1)
NetR73_1: Audio_Codec (U1.42), Audio_Output_Line_Out (R73.1)
NetU1_6: Audio_Codec (U1.6), Audio_Output_XLR1 (U21.7)
NetU1_7: Audio_Codec (U1.7), Audio_Output_XLR1 (U21.6)
NetU1_8: Audio_Codec (U1.8), Audio_Output_XLR1 (U22.7)
NetU1_9: Audio_Codec (U1.9), Audio_Output_XLR1 (U22.6)
NetU1_10: Audio_Codec (U1.10), Audio_Output_XLR2 (U23.7)
NetU1_11: Audio_Codec (U1.11), Audio_Output_XLR2 (U23.6)
NetU1_12: Audio_Codec (U1.12), Audio_Output_XLR2 (U24.7)
NetU1_13: Audio_Codec (U1.13), Audio_Output_XLR2 (U24.6)
NetU1_53: Audio_Codec (U1.53), Audio_Input_Mic_Preamp (U14.15)
NetU1_54: Audio_Codec (U1.54), Audio_Input_Mic_Preamp (U14.14)
NetU1_55: Audio_Codec (U1.55), Audio_Input_Mic_Preamp (U13.15)
NetU1_56: Audio_Codec (U1.56), Audio_Input_Mic_Preamp (U13.14)
RJ45_LED1: Audio_Input_Mic_Array (R62.1), LPC_Female_FMC (J1.H35)
RJ45_LED2: Audio_Input_Mic_Array (R63.1), LPC_Female_FMC (J1.H37)
SCLK: Audio_Codec (U1.34), Audio_Input_Mic_Preamp (U13.10 U14.10)
SDI: Audio_Codec (U1.30), Audio_Input_Mic_Preamp (U13.8)
SDO: Audio_Codec (R5.2 U1.31), Audio_Input_Mic_Preamp (U14.11)

## Assembly variants
BUILD: not fitted C25 C26 J1